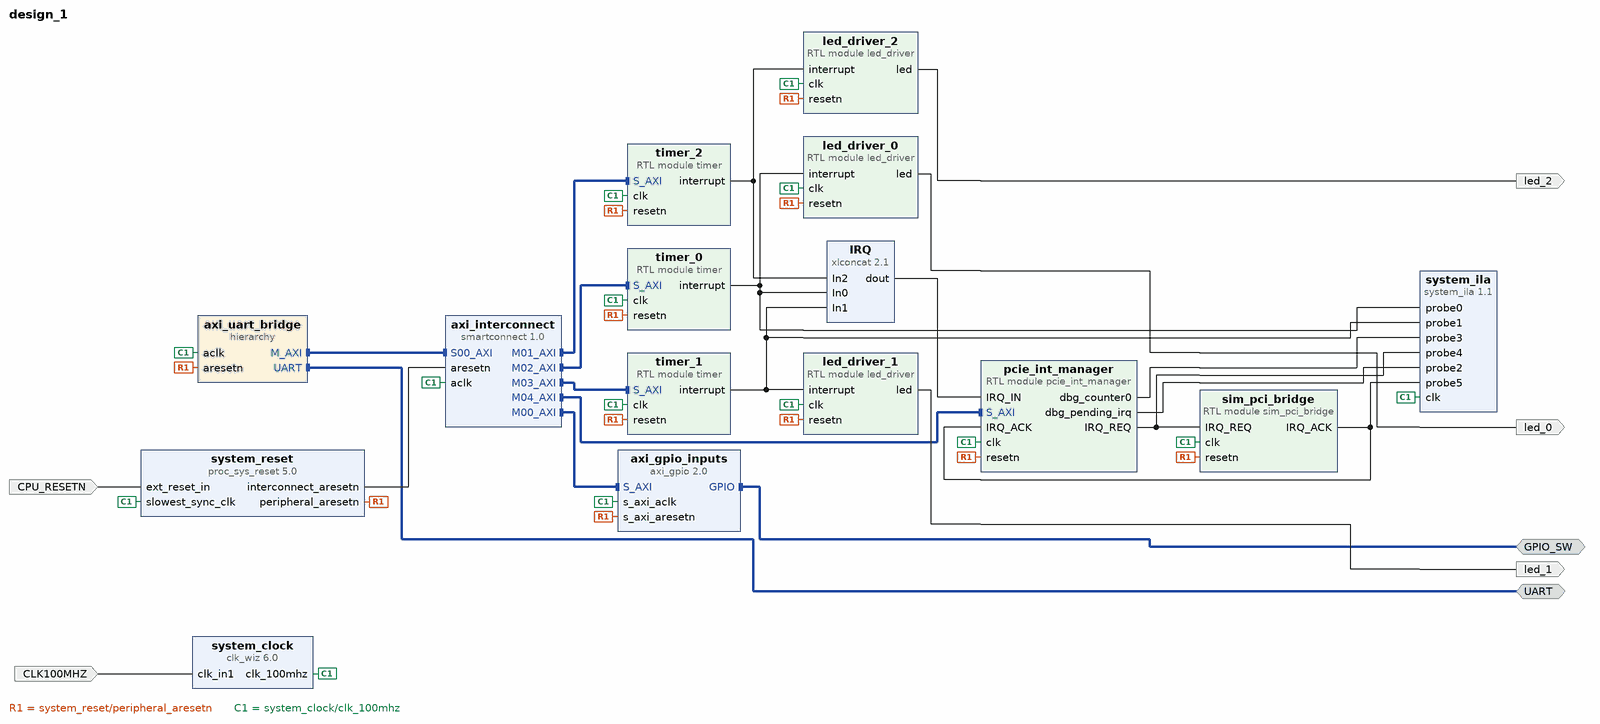
[diagram p0: block diagram of the top level]
# Vivado block design design_1, xc7a100tcsg324-1, Vivado 2021.1
create_bd_design design_1

create_bd_intf_port -mode Master -vlnv xilinx.com:interface:uart_rtl:1.0 UART
create_bd_intf_port -mode Master -vlnv xilinx.com:interface:gpio_rtl:1.0 GPIO_SW
create_bd_port -dir I -type clk CLK100MHZ
set_property -dict {CONFIG.ASSOCIATED_RESET CPU_RESETN} [get_bd_ports CLK100MHZ]
create_bd_port -dir I -type rst CPU_RESETN
create_bd_port -dir O -type intr led_0
create_bd_port -dir O led_1
create_bd_port -dir O led_2

create_bd_cell -type ip -vlnv xilinx.com:ip:clk_wiz:6.0 system_clock
set_property -dict [list \
  CONFIG.CLKOUT1_DRIVES BUFGCE \
  CONFIG.CLKOUT1_JITTER 130.958 \
  CONFIG.CLKOUT1_PHASE_ERROR 98.575 \
  CONFIG.CLKOUT1_REQUESTED_OUT_FREQ 100 \
  CONFIG.CLKOUT2_DRIVES BUFGCE \
  CONFIG.CLKOUT3_DRIVES BUFGCE \
  CONFIG.CLKOUT4_DRIVES BUFGCE \
  CONFIG.CLKOUT5_DRIVES BUFGCE \
  CONFIG.CLKOUT6_DRIVES BUFGCE \
  CONFIG.CLKOUT7_DRIVES BUFGCE \
  CONFIG.CLK_OUT1_PORT clk_100mhz \
  CONFIG.FEEDBACK_SOURCE FDBK_AUTO \
  CONFIG.MMCM_CLKFBOUT_MULT_F 10.000 \
  CONFIG.MMCM_CLKOUT0_DIVIDE_F 10.000 \
  CONFIG.MMCM_DIVCLK_DIVIDE 1 \
  CONFIG.USE_LOCKED false \
  CONFIG.USE_RESET false \
  CONFIG.USE_SAFE_CLOCK_STARTUP true \
] [get_bd_cells system_clock]
create_bd_cell -type ip -vlnv xilinx.com:ip:proc_sys_reset:5.0 system_reset
set_property -dict {CONFIG.RESET_BOARD_INTERFACE reset CONFIG.USE_BOARD_FLOW true} [get_bd_cells system_reset]
create_bd_cell -type ip -vlnv xilinx.com:ip:smartconnect:1.0 axi_interconnect
set_property -dict {CONFIG.NUM_MI 5 CONFIG.NUM_SI 1} [get_bd_cells axi_interconnect]
create_bd_cell -type hier axi_uart_bridge
create_bd_cell -type ip -vlnv xilinx.com:ip:axi_gpio:2.0 axi_gpio_inputs
set_property -dict [list \
  CONFIG.C_GPIO_WIDTH 4 \
  CONFIG.GPIO_BOARD_INTERFACE Custom \
  CONFIG.USE_BOARD_FLOW true \
] [get_bd_cells axi_gpio_inputs]
create_bd_cell -type module -reference led_driver led_driver_0
create_bd_cell -type module -reference led_driver led_driver_1
create_bd_cell -type module -reference led_driver led_driver_2
create_bd_cell -type ip -vlnv xilinx.com:ip:system_ila:1.1 system_ila
set_property -dict {CONFIG.C_MON_TYPE NATIVE CONFIG.C_NUM_OF_PROBES 7} [get_bd_cells system_ila]
create_bd_cell -type ip -vlnv xilinx.com:ip:xlconcat:2.1 IRQ
set_property -dict {CONFIG.NUM_PORTS 3} [get_bd_cells IRQ]
create_bd_cell -type module -reference timer timer_0
create_bd_cell -type module -reference timer timer_1
create_bd_cell -type module -reference timer timer_2
create_bd_cell -type module -reference pcie_int_manager pcie_int_manager
set_property -dict {CONFIG.IRQ_COUNT 3} [get_bd_cells pcie_int_manager]
create_bd_cell -type module -reference sim_pci_bridge sim_pci_bridge

# ---- hierarchy /axi_uart_bridge ----
current_bd_instance /axi_uart_bridge
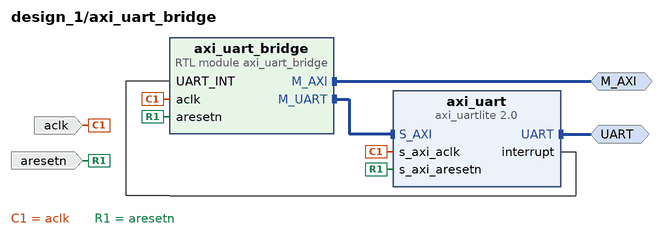
[diagram p1: block diagram inside /axi_uart_bridge]
create_bd_intf_pin -mode Master -vlnv xilinx.com:interface:aximm_rtl:1.0 M_AXI
create_bd_intf_pin -mode Master -vlnv xilinx.com:interface:uart_rtl:1.0 UART
create_bd_pin -dir I -type clk aclk
create_bd_pin -dir I -type rst aresetn

create_bd_cell -type ip -vlnv xilinx.com:ip:axi_uartlite:2.0 axi_uart
set_property -dict [list \
  CONFIG.C_BAUDRATE 115200 \
  CONFIG.UARTLITE_BOARD_INTERFACE Custom \
  CONFIG.USE_BOARD_FLOW true \
] [get_bd_cells axi_uart]
create_bd_cell -type module -reference axi_uart_bridge axi_uart_bridge
set_property -dict {CONFIG.CLOCK_FREQ 50000000} [get_bd_cells axi_uart_bridge]

# ---- connections ----

current_bd_instance /axi_uart_bridge
connect_bd_intf_net [get_bd_intf_pins UART] [get_bd_intf_pins axi_uart/UART]
connect_bd_intf_net [get_bd_intf_pins M_AXI] [get_bd_intf_pins axi_uart_bridge/M_AXI]
connect_bd_intf_net [get_bd_intf_pins axi_uart_bridge/M_UART] [get_bd_intf_pins axi_uart/S_AXI]
connect_bd_net [get_bd_pins aclk] [get_bd_pins axi_uart/s_axi_aclk] [get_bd_pins axi_uart_bridge/aclk]
connect_bd_net [get_bd_pins aresetn] [get_bd_pins axi_uart/s_axi_aresetn] [get_bd_pins axi_uart_bridge/aresetn]
connect_bd_net [get_bd_pins axi_uart/interrupt] [get_bd_pins axi_uart_bridge/UART_INT]

current_bd_instance /
connect_bd_intf_net [get_bd_intf_ports GPIO_SW] [get_bd_intf_pins axi_gpio_inputs/GPIO]
connect_bd_intf_net [get_bd_intf_pins axi_interconnect/M00_AXI] [get_bd_intf_pins axi_gpio_inputs/S_AXI]
connect_bd_intf_net [get_bd_intf_pins timer_2/S_AXI] [get_bd_intf_pins axi_interconnect/M01_AXI]
connect_bd_intf_net [get_bd_intf_pins timer_0/S_AXI] [get_bd_intf_pins axi_interconnect/M02_AXI]
connect_bd_intf_net [get_bd_intf_pins timer_1/S_AXI] [get_bd_intf_pins axi_interconnect/M03_AXI]
connect_bd_intf_net [get_bd_intf_pins pcie_int_manager/S_AXI] [get_bd_intf_pins axi_interconnect/M04_AXI]
connect_bd_intf_net -intf_net hier_0_M_AXI [get_bd_intf_pins axi_interconnect/S00_AXI] [get_bd_intf_pins axi_uart_bridge/M_AXI]
connect_bd_intf_net -intf_net hier_0_UART [get_bd_intf_ports UART] [get_bd_intf_pins axi_uart_bridge/UART]
connect_bd_net -net IRQ_ACK [get_bd_pins sim_pci_bridge/IRQ_ACK] [get_bd_pins system_ila/probe5] [get_bd_pins pcie_int_manager/IRQ_ACK]
connect_bd_net -net IRQ_REQ [get_bd_pins pcie_int_manager/IRQ_REQ] [get_bd_pins system_ila/probe4] [get_bd_pins sim_pci_bridge/IRQ_REQ]
connect_bd_net [get_bd_pins IRQ/dout] [get_bd_pins pcie_int_manager/IRQ_IN]
connect_bd_net -net clk_in1_0_1 [get_bd_ports CLK100MHZ] [get_bd_pins system_clock/clk_in1]
connect_bd_net -net dbg_counter0 [get_bd_pins pcie_int_manager/dbg_counter0] [get_bd_pins system_ila/probe3]
connect_bd_net -net dbg_pending_irq [get_bd_pins pcie_int_manager/dbg_pending_irq] [get_bd_pins system_ila/probe2]
connect_bd_net -net ext_reset_in_0_1 [get_bd_ports CPU_RESETN] [get_bd_pins system_reset/ext_reset_in]
connect_bd_net [get_bd_pins led_driver_0/led] [get_bd_ports led_0]
connect_bd_net [get_bd_pins led_driver_1/led] [get_bd_ports led_1]
connect_bd_net [get_bd_pins led_driver_2/led] [get_bd_ports led_2]
connect_bd_net -net proc_sys_reset_0_peripheral_aresetn [get_bd_pins system_reset/peripheral_aresetn] \
  [get_bd_pins axi_uart_bridge/aresetn] [get_bd_pins axi_gpio_inputs/s_axi_aresetn] [get_bd_pins led_driver_0/resetn] \
  [get_bd_pins led_driver_2/resetn] [get_bd_pins led_driver_1/resetn] [get_bd_pins timer_0/resetn] \
  [get_bd_pins timer_1/resetn] [get_bd_pins timer_2/resetn] [get_bd_pins pcie_int_manager/resetn] \
  [get_bd_pins sim_pci_bridge/resetn]
connect_bd_net [get_bd_pins system_clock/clk_100mhz] \
  [get_bd_pins system_reset/slowest_sync_clk] [get_bd_pins axi_interconnect/aclk] [get_bd_pins axi_uart_bridge/aclk] \
  [get_bd_pins axi_gpio_inputs/s_axi_aclk] [get_bd_pins led_driver_0/clk] [get_bd_pins led_driver_2/clk] \
  [get_bd_pins led_driver_1/clk] [get_bd_pins system_ila/clk] [get_bd_pins timer_0/clk] [get_bd_pins timer_1/clk] \
  [get_bd_pins timer_2/clk] [get_bd_pins pcie_int_manager/clk] [get_bd_pins sim_pci_bridge/clk]
connect_bd_net [get_bd_pins system_reset/interconnect_aresetn] [get_bd_pins axi_interconnect/aresetn]
connect_bd_net [get_bd_pins timer_0/interrupt] [get_bd_pins led_driver_0/interrupt] [get_bd_pins system_ila/probe0] [get_bd_pins IRQ/In0]
connect_bd_net [get_bd_pins timer_1/interrupt] [get_bd_pins led_driver_1/interrupt] [get_bd_pins IRQ/In1] [get_bd_pins system_ila/probe1]
connect_bd_net [get_bd_pins timer_2/interrupt] [get_bd_pins led_driver_2/interrupt] [get_bd_pins IRQ/In2]

# ---- address map ----
assign_bd_address -offset 0x0000000000000000 -range 256 -target_address_space [get_bd_addr_spaces axi_uart_bridge/axi_uart_bridge/M_AXI] [get_bd_addr_segs pcie_int_manager/S_AXI/reg0]
assign_bd_address -offset 0x0000000000001000 -range 128 -target_address_space [get_bd_addr_spaces axi_uart_bridge/axi_uart_bridge/M_AXI] [get_bd_addr_segs timer_0/S_AXI/reg0]
assign_bd_address -offset 0x0000000000002000 -range 128 -target_address_space [get_bd_addr_spaces axi_uart_bridge/axi_uart_bridge/M_AXI] [get_bd_addr_segs timer_1/S_AXI/reg0]
assign_bd_address -offset 0x0000000000003000 -range 128 -target_address_space [get_bd_addr_spaces axi_uart_bridge/axi_uart_bridge/M_AXI] [get_bd_addr_segs timer_2/S_AXI/reg0]
assign_bd_address -offset 0x0000000000009000 -range 128 -target_address_space [get_bd_addr_spaces axi_uart_bridge/axi_uart_bridge/M_AXI] [get_bd_addr_segs axi_gpio_inputs/S_AXI/Reg]
assign_bd_address -offset 0x40600000 -range 64K -target_address_space [get_bd_addr_spaces axi_uart_bridge/axi_uart_bridge/M_UART] [get_bd_addr_segs axi_uart_bridge/axi_uart/S_AXI/Reg]

validate_bd_design
save_bd_design
